# EAGLE design Raine (EAGLE 9.6.2)

## Sheet 1 of 5
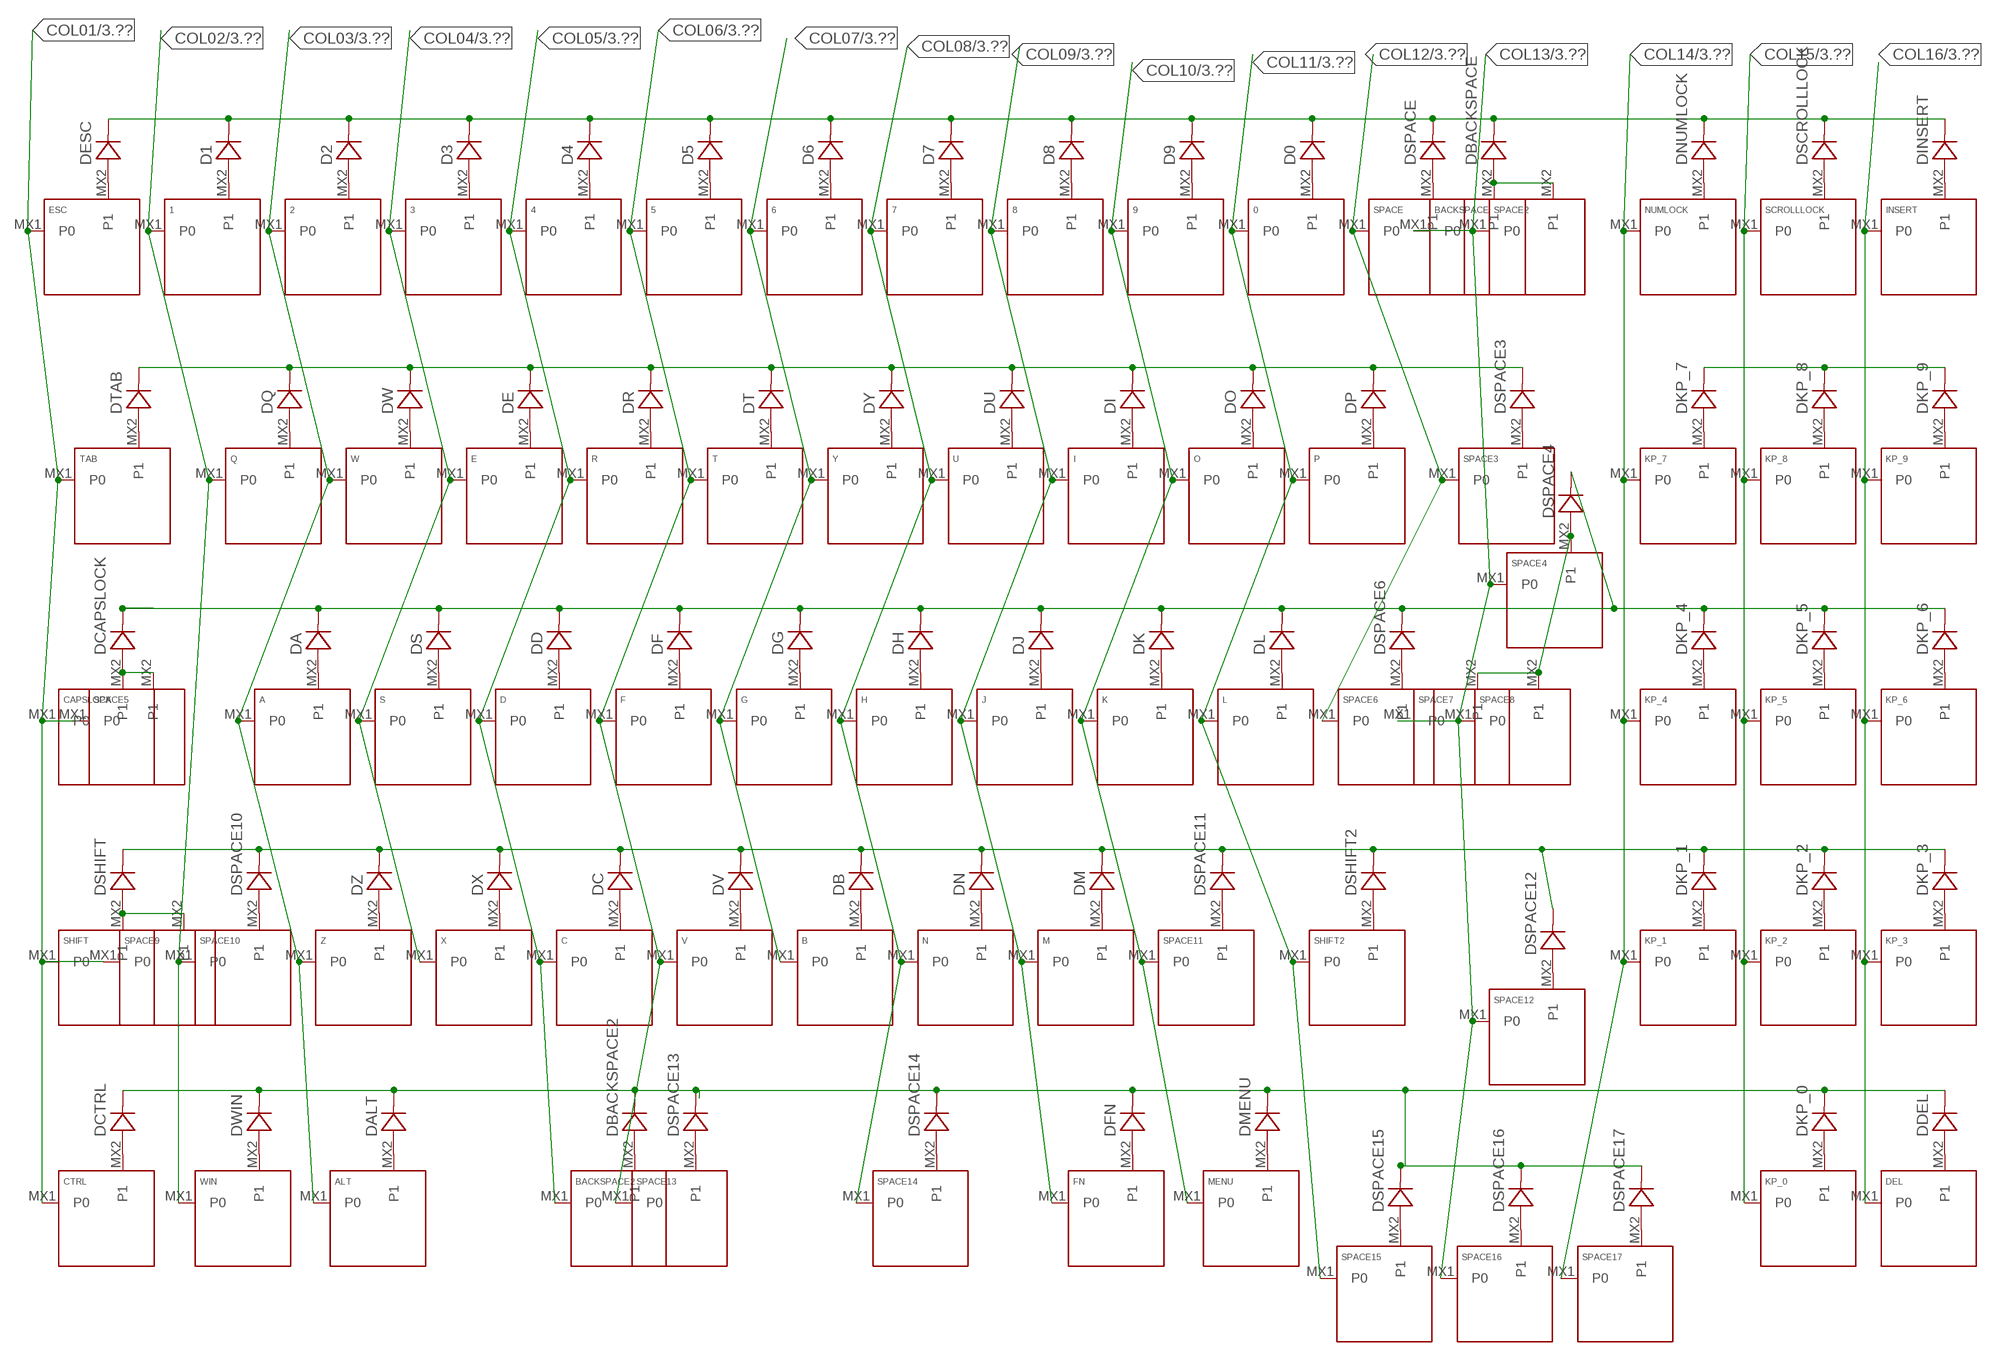
[diagram p0: schematic, sheet 1]

### Parts
0  KEYSWITCHMX-1U  [MX-1U]
1  KEYSWITCHMX-1U  [MX-1U]
2  KEYSWITCHMX-1U  [MX-1U]
3  KEYSWITCHMX-1U  [MX-1U]
4  KEYSWITCHMX-1U  [MX-1U]
5  KEYSWITCHMX-1U  [MX-1U]
6  KEYSWITCHMX-1U  [MX-1U]
7  KEYSWITCHMX-1U  [MX-1U]
8  KEYSWITCHMX-1U  [MX-1U]
9  KEYSWITCHMX-1U  [MX-1U]
A  KEYSWITCHMX-1U  [MX-1U]
ALT  KEYSWITCHMX-1U  [MX-1U]
B  KEYSWITCHMX-1U  [MX-1U]
BACKSPACE  KEYSWITCHMX-2U  [MX-2U]
BACKSPACE2  KEYSWITCHMX-2U-FLIPPED  [MX-2U-FLIPPED]
C  KEYSWITCHMX-1U  [MX-1U]
CAPSLOCK  KEYSWITCHMX-1U  [MX-1U]
CTRL  KEYSWITCHMX-1U  [MX-1U]
D  KEYSWITCHMX-1U  [MX-1U]
D0  D_SOD123-SOD-123  [SOD-123]
D1  D_SOD123-SOD-123  [SOD-123]
D2  D_SOD123-SOD-123  [SOD-123]
D3  D_SOD123-SOD-123  [SOD-123]
D4  D_SOD123-SOD-123  [SOD-123]
D5  D_SOD123-SOD-123  [SOD-123]
D6  D_SOD123-SOD-123  [SOD-123]
D7  D_SOD123-SOD-123  [SOD-123]
D8  D_SOD123-SOD-123  [SOD-123]
D9  D_SOD123-SOD-123  [SOD-123]
DA  D_SOD123-SOD-123  [SOD-123]
DALT  D_SOD123-SOD-123  [SOD-123]
DB  D_SOD123-SOD-123  [SOD-123]
DBACKSPACE  D_SOD123-SOD-123  [SOD-123]
DBACKSPACE2  D_SOD123-SOD-123  [SOD-123]
DC  D_SOD123-SOD-123  [SOD-123]
DCAPSLOCK  D_SOD123-SOD-123  [SOD-123]
DCTRL  D_SOD123-SOD-123  [SOD-123]
DD  D_SOD123-SOD-123  [SOD-123]
DDEL  D_SOD123-SOD-123  [SOD-123]
DE  D_SOD123-SOD-123  [SOD-123]
DEL  KEYSWITCHMX-1U  [MX-1U]
DESC  D_SOD123-SOD-123  [SOD-123]
DF  D_SOD123-SOD-123  [SOD-123]
DFN  D_SOD123-SOD-123  [SOD-123]
DG  D_SOD123-SOD-123  [SOD-123]
DH  D_SOD123-SOD-123  [SOD-123]
DI  D_SOD123-SOD-123  [SOD-123]
DINSERT  D_SOD123-SOD-123  [SOD-123]
DJ  D_SOD123-SOD-123  [SOD-123]
DK  D_SOD123-SOD-123  [SOD-123]
DKP_0  D_SOD123-SOD-123  [SOD-123]
DKP_1  D_SOD123-SOD-123  [SOD-123]
DKP_2  D_SOD123-SOD-123  [SOD-123]
DKP_3  D_SOD123-SOD-123  [SOD-123]
DKP_4  D_SOD123-SOD-123  [SOD-123]
DKP_5  D_SOD123-SOD-123  [SOD-123]
DKP_6  D_SOD123-SOD-123  [SOD-123]
DKP_7  D_SOD123-SOD-123  [SOD-123]
DKP_8  D_SOD123-SOD-123  [SOD-123]
DKP_9  D_SOD123-SOD-123  [SOD-123]
DL  D_SOD123-SOD-123  [SOD-123]
DM  D_SOD123-SOD-123  [SOD-123]
DMENU  D_SOD123-SOD-123  [SOD-123]
DN  D_SOD123-SOD-123  [SOD-123]
DNUMLOCK  D_SOD123-SOD-123  [SOD-123]
DO  D_SOD123-SOD-123  [SOD-123]
DP  D_SOD123-SOD-123  [SOD-123]
DQ  D_SOD123-SOD-123  [SOD-123]
DR  D_SOD123-SOD-123  [SOD-123]
DS  D_SOD123-SOD-123  [SOD-123]
DSCROLLLOCK  D_SOD123-SOD-123  [SOD-123]
DSHIFT  D_SOD123-SOD-123  [SOD-123]
DSHIFT2  D_SOD123-SOD-123  [SOD-123]
DSPACE  D_SOD123-SOD-123  [SOD-123]
DSPACE3  D_SOD123-SOD-123  [SOD-123]
DSPACE4  D_SOD123-SOD-123  [SOD-123]
DSPACE6  D_SOD123-SOD-123  [SOD-123]
DSPACE10  D_SOD123-SOD-123  [SOD-123]
DSPACE11  D_SOD123-SOD-123  [SOD-123]
DSPACE12  D_SOD123-SOD-123  [SOD-123]
DSPACE13  D_SOD123-SOD-123  [SOD-123]
DSPACE14  D_SOD123-SOD-123  [SOD-123]
DSPACE15  D_SOD123-SOD-123  [SOD-123]
DSPACE16  D_SOD123-SOD-123  [SOD-123]
DSPACE17  D_SOD123-SOD-123  [SOD-123]
DT  D_SOD123-SOD-123  [SOD-123]
DTAB  D_SOD123-SOD-123  [SOD-123]
DU  D_SOD123-SOD-123  [SOD-123]
DV  D_SOD123-SOD-123  [SOD-123]
DW  D_SOD123-SOD-123  [SOD-123]
DWIN  D_SOD123-SOD-123  [SOD-123]
DX  D_SOD123-SOD-123  [SOD-123]
DY  D_SOD123-SOD-123  [SOD-123]
DZ  D_SOD123-SOD-123  [SOD-123]
E  KEYSWITCHMX-1U  [MX-1U]
ESC  KEYSWITCHMX-1U  [MX-1U]
F  KEYSWITCHMX-1U  [MX-1U]
FN  KEYSWITCHMX-1U  [MX-1U]
G  KEYSWITCHMX-1U  [MX-1U]
H  KEYSWITCHMX-1U  [MX-1U]
I  KEYSWITCHMX-1U  [MX-1U]
INSERT  KEYSWITCHMX-1U  [MX-1U]
J  KEYSWITCHMX-1U  [MX-1U]
K  KEYSWITCHMX-1U  [MX-1U]
KP_0  KEYSWITCHMX-1U  [MX-1U]
KP_1  KEYSWITCHMX-1U  [MX-1U]
KP_2  KEYSWITCHMX-1U  [MX-1U]
KP_3  KEYSWITCHMX-1U  [MX-1U]
KP_4  KEYSWITCHMX-1U  [MX-1U]
KP_5  KEYSWITCHMX-1U  [MX-1U]
KP_6  KEYSWITCHMX-1U  [MX-1U]
KP_7  KEYSWITCHMX-1U  [MX-1U]
KP_8  KEYSWITCHMX-1U  [MX-1U]
KP_9  KEYSWITCHMX-1U  [MX-1U]
L  KEYSWITCHMX-1U  [MX-1U]
M  KEYSWITCHMX-1U  [MX-1U]
MENU  KEYSWITCHMX-1U  [MX-1U]
N  KEYSWITCHMX-1U  [MX-1U]
NUMLOCK  KEYSWITCHMX-1U  [MX-1U]
O  KEYSWITCHMX-1U  [MX-1U]
P  KEYSWITCHMX-1U  [MX-1U]
Q  KEYSWITCHMX-1U  [MX-1U]
R  KEYSWITCHMX-1U  [MX-1U]
S  KEYSWITCHMX-1U  [MX-1U]
SCROLLLOCK  KEYSWITCHMX-1U  [MX-1U]
SHIFT  KEYSWITCHMX-1U  [MX-1U]
SHIFT2  KEYSWITCHMX-1U  [MX-1U]
SPACE  KEYSWITCHMX-1U  [MX-1U]
SPACE2  KEYSWITCHMX-1U  [MX-1U]
SPACE3  KEYSWITCHMX-1U  [MX-1U]
SPACE4  KEYSWITCHMX-2U-FLIPPED  [MX-2U-FLIPPED]
SPACE5  KEYSWITCHMX-1U  [MX-1U]
SPACE6  KEYSWITCHMX-1U  [MX-1U]
SPACE7  KEYSWITCHMX-2U  [MX-2U]
SPACE8  KEYSWITCHMX-1U  [MX-1U]
SPACE9  KEYSWITCHMX-2U  [MX-2U]
SPACE10  KEYSWITCHMX-1U  [MX-1U]
SPACE11  KEYSWITCHMX-1U  [MX-1U]
SPACE12  KEYSWITCHMX-1U  [MX-1U]
SPACE13  KEYSWITCHMX-6.25U-FLIPPED  [MX-6.25U-FLIPPED]
SPACE14  KEYSWITCHMX-2U-FLIPPED  [MX-2U-FLIPPED]
SPACE15  KEYSWITCHMX-1U  [MX-1U]
SPACE16  KEYSWITCHMX-1U  [MX-1U]
SPACE17  KEYSWITCHMX-1U  [MX-1U]
T  KEYSWITCHMX-1U  [MX-1U]
TAB  KEYSWITCHMX-1U  [MX-1U]
U  KEYSWITCHMX-1U  [MX-1U]
V  KEYSWITCHMX-1U  [MX-1U]
W  KEYSWITCHMX-1U  [MX-1U]
WIN  KEYSWITCHMX-1U  [MX-1U]
X  KEYSWITCHMX-1U  [MX-1U]
Y  KEYSWITCHMX-1U  [MX-1U]
Z  KEYSWITCHMX-1U  [MX-1U]

### Nets
COL01: CAPSLOCK.MX1(P0) CTRL.MX1(P0) ESC.MX1(P0) SHIFT.MX1(P0) SPACE5.MX1(P0) SPACE9.MX1(P0) TAB.MX1(P0) ; also sheet 3
COL02: 1.MX1(P0) Q.MX1(P0) SPACE10.MX1(P0) WIN.MX1(P0) ; also sheet 3
COL03: 2.MX1(P0) A.MX1(P0) ALT.MX1(P0) W.MX1(P0) Z.MX1(P0) ; also sheet 3
COL04: 3.MX1(P0) E.MX1(P0) S.MX1(P0) X.MX1(P0) ; also sheet 3
COL05: 4.MX1(P0) BACKSPACE2.MX1(P0) C.MX1(P0) D.MX1(P0) R.MX1(P0) ; also sheet 3
COL06: 5.MX1(P0) F.MX1(P0) SPACE13.MX1(P0) T.MX1(P0) V.MX1(P0) ; also sheet 3
COL07: 6.MX1(P0) B.MX1(P0) G.MX1(P0) Y.MX1(P0) ; also sheet 3
COL08: 7.MX1(P0) H.MX1(P0) N.MX1(P0) SPACE14.MX1(P0) U.MX1(P0) ; also sheet 3
COL09: 8.MX1(P0) FN.MX1(P0) I.MX1(P0) J.MX1(P0) M.MX1(P0) ; also sheet 3
COL10: 9.MX1(P0) K.MX1(P0) MENU.MX1(P0) O.MX1(P0) SPACE11.MX1(P0) ; also sheet 3
COL11: 0.MX1(P0) L.MX1(P0) P.MX1(P0) SHIFT2.MX1(P0) SPACE15.MX1(P0) ; also sheet 3
COL12: SPACE3.MX1(P0) SPACE6.MX1(P0) SPACE.MX1(P0) ; also sheet 3
COL13: BACKSPACE.MX1(P0) SPACE2.MX1(P0) SPACE4.MX1(P0) SPACE7.MX1(P0) SPACE8.MX1(P0) SPACE12.MX1(P0) SPACE16.MX1(P0) ; also sheet 3
COL14: KP_1.MX1(P0) KP_4.MX1(P0) KP_7.MX1(P0) NUMLOCK.MX1(P0) SPACE17.MX1(P0) ; also sheet 3
COL15: KP_0.MX1(P0) KP_2.MX1(P0) KP_5.MX1(P0) KP_8.MX1(P0) SCROLLLOCK.MX1(P0) ; also sheet 3
COL16: DEL.MX1(P0) INSERT.MX1(P0) KP_3.MX1(P0) KP_6.MX1(P0) KP_9.MX1(P0) ; also sheet 3
N$1: DTAB.A TAB.MX2(P1)
N$2: DQ.A Q.MX2(P1)
N$3: DW.A W.MX2(P1)
N$4: DE.A E.MX2(P1)
N$5: DR.A R.MX2(P1)
N$6: DT.A T.MX2(P1)
N$7: DY.A Y.MX2(P1)
N$8: DU.A U.MX2(P1)
N$9: DI.A I.MX2(P1)
N$10: DO.A O.MX2(P1)
N$11: DP.A P.MX2(P1)
N$12: DSPACE3.A SPACE3.MX2(P1)
N$13: DKP_7.A KP_7.MX2(P1)
N$14: DKP_8.A KP_8.MX2(P1)
N$15: DKP_9.A KP_9.MX2(P1)
N$16: DNUMLOCK.A NUMLOCK.MX2(P1)
N$17: CAPSLOCK.MX2(P1) DCAPSLOCK.A SPACE5.MX2(P1)
N$18: A.MX2(P1) DA.A
N$19: DS.A S.MX2(P1)
N$20: D.MX2(P1) DD.A
N$21: DF.A F.MX2(P1)
N$22: DG.A G.MX2(P1)
N$23: DH.A H.MX2(P1)
N$24: DJ.A J.MX2(P1)
N$25: DK.A K.MX2(P1)
N$26: DL.A L.MX2(P1)
N$27: DSPACE6.A SPACE6.MX2(P1)
N$28: DSPACE4.A SPACE4.MX2(P1) SPACE7.MX2(P1) SPACE8.MX2(P1)
N$29: DSCROLLLOCK.A SCROLLLOCK.MX2(P1)
N$30: DKP_4.A KP_4.MX2(P1)
N$31: DKP_5.A KP_5.MX2(P1)
N$32: DKP_6.A KP_6.MX2(P1)
N$33: DSHIFT.A SHIFT.MX2(P1) SPACE9.MX2(P1)
N$34: DINSERT.A INSERT.MX2(P1)
N$35: DSPACE10.A SPACE10.MX2(P1)
N$36: DZ.A Z.MX2(P1)
N$37: DX.A X.MX2(P1)
N$38: C.MX2(P1) DC.A
N$39: DV.A V.MX2(P1)
N$40: B.MX2(P1) DB.A
N$41: DN.A N.MX2(P1)
N$42: DM.A M.MX2(P1)
N$43: DSPACE11.A SPACE11.MX2(P1)
N$44: DSHIFT2.A SHIFT2.MX2(P1)
N$45: DKP_1.A KP_1.MX2(P1)
N$46: DKP_2.A KP_2.MX2(P1)
N$47: DKP_3.A KP_3.MX2(P1)
N$48: DSPACE12.A SPACE12.MX2(P1)
N$49: CTRL.MX2(P1) DCTRL.A
N$50: DWIN.A WIN.MX2(P1)
N$51: ALT.MX2(P1) DALT.A
N$52: DSPACE13.A SPACE13.MX2(P1)
N$53: BACKSPACE2.MX2(P1) DBACKSPACE2.A
N$54: DSPACE14.A SPACE14.MX2(P1)
N$55: DFN.A FN.MX2(P1)
N$56: DMENU.A MENU.MX2(P1)
N$57: DKP_0.A KP_0.MX2(P1)
N$58: DDEL.A DEL.MX2(P1)
N$59: DSPACE15.A SPACE15.MX2(P1)
N$60: DSPACE16.A SPACE16.MX2(P1)
N$61: DSPACE17.A SPACE17.MX2(P1)
N$62: DSPACE.A SPACE.MX2(P1)
N$63: 0.MX2(P1) D0.A
N$64: 9.MX2(P1) D9.A
N$65: 8.MX2(P1) D8.A
N$66: 7.MX2(P1) D7.A
N$67: 6.MX2(P1) D6.A
N$68: 5.MX2(P1) D5.A
N$69: DESC.A ESC.MX2(P1)
N$70: 1.MX2(P1) D1.A
N$71: 2.MX2(P1) D2.A
N$72: 3.MX2(P1) D3.A
N$73: 4.MX2(P1) D4.A
N$76: BACKSPACE.MX2(P1) DBACKSPACE.A SPACE2.MX2(P1)
ROW1: D0.C D1.C D2.C D3.C D4.C D5.C D6.C D7.C D8.C D9.C DBACKSPACE.C DESC.C DINSERT.C DNUMLOCK.C DSCROLLLOCK.C DSPACE.C ; also sheet 3
ROW2: DE.C DI.C DKP_7.C DKP_8.C DKP_9.C DO.C DP.C DQ.C DR.C DSPACE3.C DT.C DTAB.C DU.C DW.C DY.C ; also sheet 3
ROW3: DA.C DCAPSLOCK.C DD.C DF.C DG.C DH.C DJ.C DK.C DKP_4.C DKP_5.C DKP_6.C DL.C DS.C DSPACE4.C DSPACE6.C ; also sheet 3
ROW4: DB.C DC.C DKP_1.C DKP_2.C DKP_3.C DM.C DN.C DSHIFT2.C DSHIFT.C DSPACE10.C DSPACE11.C DSPACE12.C DV.C DX.C DZ.C ; also sheet 3
ROW5.25: DALT.C DBACKSPACE2.C DCTRL.C DDEL.C DFN.C DKP_0.C DMENU.C DSPACE13.C DSPACE14.C DSPACE15.C DSPACE16.C DSPACE17.C DWIN.C ; also sheet 3

## Sheet 2 of 5
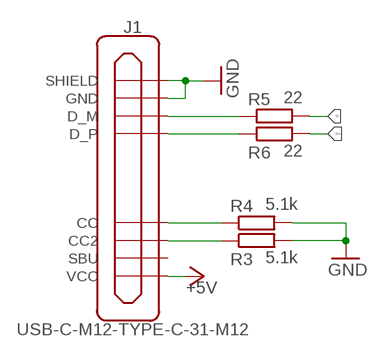
[diagram p1: schematic, sheet 2]

### Parts
J1  USB-C-M12-TYPE-C-31-M12  [TYPE-C-31-M-12]
R3  5.1k  R0603  [CAPC1608X90]
R4  5.1k  R0603  [CAPC1608X90]
R5  22  R0603  [CAPC1608X90]
R6  22  R0603  [CAPC1608X90]

### Nets
+5V: J1.P$2(VCC) J1.P$11(VCC) ; also sheet 3,5
D+: R6.2 ; also sheet 3
D-: R5.2 ; also sheet 3
GND: J1.P$1(GND) J1.P$12(GND) J1.P$13(SHIELD) J1.P$14(SHIELD) J1.P$15(SHIELD) J1.P$16(SHIELD) R3.2 R4.2 ; also sheet 3,4,5
N$74: J1.P$6(D_P) J1.P$8(D_P) R6.1
N$75: J1.P$5(D_M) J1.P$7(D_M) R5.1
N$77: J1.P$10(CC2) R3.1
N$78: J1.P$4(CC) R4.1
Unconnected: J1.P$3(SBU) J1.P$9(SBU)

## Sheet 3 of 5
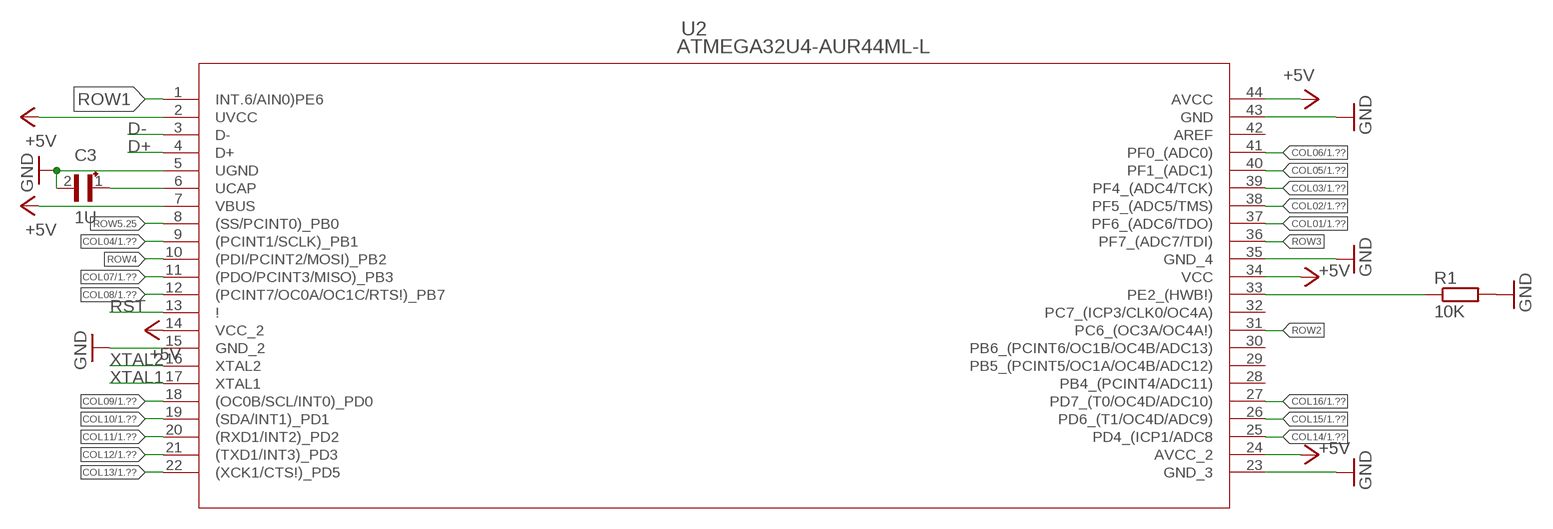
[diagram p2: schematic, sheet 3]

### Parts
C3  1U  C0603  [CAPC1608X90]
R1  10K  R0603  [CAPC1608X90]
U2  ATMEGA32U4-AUR44ML-L  [44ML-L]

### Nets
+5V: U2.2(UVCC) U2.7(VBUS) U2.14(VCC_2) U2.24(AVCC_2) U2.34(VCC) U2.44(AVCC) ; also sheet 2,5
COL01: U2.37(PF6_(ADC6/TDO)) ; also sheet 1
COL02: U2.38(PF5_(ADC5/TMS)) ; also sheet 1
COL03: U2.39(PF4_(ADC4/TCK)) ; also sheet 1
COL04: U2.9((PCINT1/SCLK)_PB1) ; also sheet 1
COL05: U2.40(PF1_(ADC1)) ; also sheet 1
COL06: U2.41(PF0_(ADC0)) ; also sheet 1
COL07: U2.11((PDO/PCINT3/MISO)_PB3) ; also sheet 1
COL08: U2.12((PCINT7/OC0A/OC1C/RTS!)_PB7) ; also sheet 1
COL09: U2.18((OC0B/SCL/INT0)_PD0) ; also sheet 1
COL10: U2.19((SDA/INT1)_PD1) ; also sheet 1
COL11: U2.20((RXD1/INT2)_PD2) ; also sheet 1
COL12: U2.21((TXD1/INT3)_PD3) ; also sheet 1
COL13: U2.22((XCK1/CTS!)_PD5) ; also sheet 1
COL14: U2.25(PD4_(ICP1/ADC8) ; also sheet 1
COL15: U2.26(PD6_(T1/OC4D/ADC9)) ; also sheet 1
COL16: U2.27(PD7_(T0/OC4D/ADC10)) ; also sheet 1
D+: U2.4(D+) ; also sheet 2
D-: U2.3(D-) ; also sheet 2
GND: C3.2 R1.2 U2.5(UGND) U2.15(GND_2) U2.23(GND_3) U2.35(GND_4) U2.43(GND) ; also sheet 2,4,5
N$87: C3.1 U2.6(UCAP)
N$88: R1.1 U2.33(PE2_(HWB!))
ROW1: U2.1(INT.6/AIN0)PE6) ; also sheet 1
ROW2: U2.31(PC6_(OC3A/OC4A!)) ; also sheet 1
ROW3: U2.36(PF7_(ADC7/TDI)) ; also sheet 1
ROW4: U2.10((PDI/PCINT2/MOSI)_PB2) ; also sheet 1
ROW5.25: U2.8((SS/PCINT0)_PB0) ; also sheet 1
RST: U2.13(!) ; also sheet 5
XTAL1: U2.17(XTAL1) ; also sheet 4
XTAL2: U2.16(XTAL2) ; also sheet 4
Unconnected: U2.28(PB4_(PCINT4/ADC11)) U2.29(PB5_(PCINT5/OC1A/OC4B/ADC12)) U2.30(PB6_(PCINT6/OC1B/OC4B/ADC13)) U2.32(PC7_(ICP3/CLK0/OC4A)) U2.42(AREF)

## Sheet 4 of 5
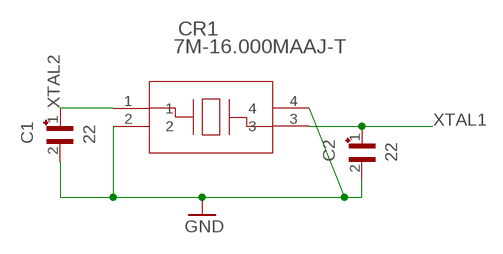
[diagram p3: schematic, sheet 4]

### Parts
C1  22  C0603  [CAPC1608X90]
C2  22  C0603  [CAPC1608X90]
CR1  7M-16.000MAAJ-T  [CRYSTAL_TXC_7M]

### Nets
GND: C1.2 C2.2 CR1.2 CR1.4 ; also sheet 2,3,5
XTAL1: C2.1 CR1.3 ; also sheet 3
XTAL2: C1.1 CR1.1 ; also sheet 3

## Sheet 5 of 5
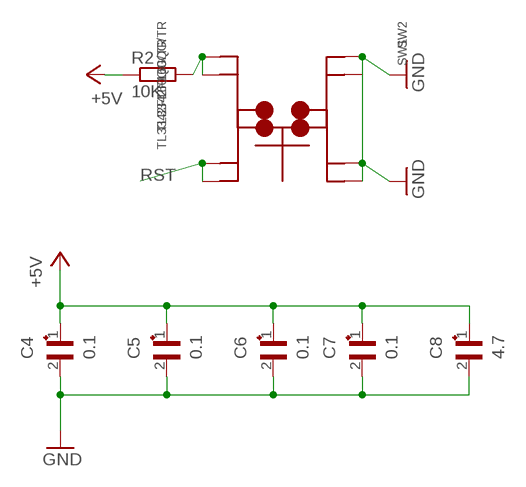
[diagram p4: schematic, sheet 5]

### Parts
C4  0.1  C0603  [CAPC1608X90]
C5  0.1  C0603  [CAPC1608X90]
C6  0.1  C0603  [CAPC1608X90]
C7  0.1  C0603  [CAPC1608X90]
C8  4.7  C0603  [CAPC1608X90]
R2  10K  R0603  [CAPC1608X90]
SW1  TL3342F160QG/TR  [SW_TL3342F160QG/TR]
SW2  TL3342F160QG/TR  [SW_TL3342F160QG/TR]

### Nets
+5V: C4.1 C5.1 C6.1 C7.1 C8.1 R2.1 ; also sheet 2,3
GND: C4.2 C5.2 C6.2 C7.2 C8.2 SW1.3 SW1.4 SW2.3 SW2.4 ; also sheet 2,3,4
N$89: R2.2 SW1.1 SW2.1
RST: SW1.2 SW2.2 ; also sheet 3

## Library data of the parts
0 1-9 A ALT B BACKSPACE BACKSPACE2 C CAPSLOCK CTRL D DEL E ESC F FN G H I INSERT J K KP_0 KP_1-KP_9 L M MENU N NUMLOCK O P Q R S SCROLLLOCK SHIFT SHIFT2 SPACE SPACE2-SPACE17 T TAB U V W WIN X Y Z = Keyboard_parts:KEYSWITCH
C1-C8 = Keyboard_parts:C0603: Capacitor 0603; AVAILABILITY: Unavailable; DESCRIPTION: Cap Cer 10000pf 10v 10% X7r 0603; MF: AVX; MP: 0603ZC103KAJ2A; PACKAGE: 0603 AVX; PRICE: None
CR1 = Keyboard_parts:7M-16.000MAAJ-T; MANUFACTURER_PART_NUMBER: 7M16.000MAAJT; VENDOR: TXC
D0 D1-D9 DA DALT DB DBACKSPACE DBACKSPACE2 DC DCAPSLOCK DCTRL DD DDEL DE DESC DF DFN DG DH DI DINSERT DJ DK DKP_0 DKP_1-DKP_9 DL DM DMENU DN DNUMLOCK DO DP DQ DR DS DSCROLLLOCK DSHIFT DSHIFT2 DSPACE DSPACE3 DSPACE4 DSPACE6 DSPACE10-DSPACE17 DT DTAB DU DV DW DWIN DX DY DZ = Keyboard_parts:D_SOD123: Standard 1N4148 diode
J1 = Keyboard_parts:USB-C-M12
R1-R6 = Keyboard_parts:R0603: Resistor 0603
SW1 SW2 = Keyboard_parts:TL3342F160QG/TR: TL3342 Series SPST 1.6 N Round Button Gull Wing Surface Mount Tactile Switch; DESCRIPTION: Switch Tactile Spst-No 0.05a 12v; DIGI-KEY_PART_NUMBER: EG2531CT-ND; DIGI-KEY_PURCHASE_URL: https://www.digikey.co.uk/product-detail/en/e-switch/TL3342F160QG-TR/EG2531CT-ND/379004?utm_source=snapeda&utm_medium=aggregator&utm_campaign=symbol; MF: E-Switch; MP: TL3342F160QG/TR; PACKAGE: FakePackage u
U2 = Keyboard_parts:ATMEGA32U4-AUR; MANUFACTURER_PART_NUMBER: ATMEGA32U4AUR; VENDOR: Atmel

## Board
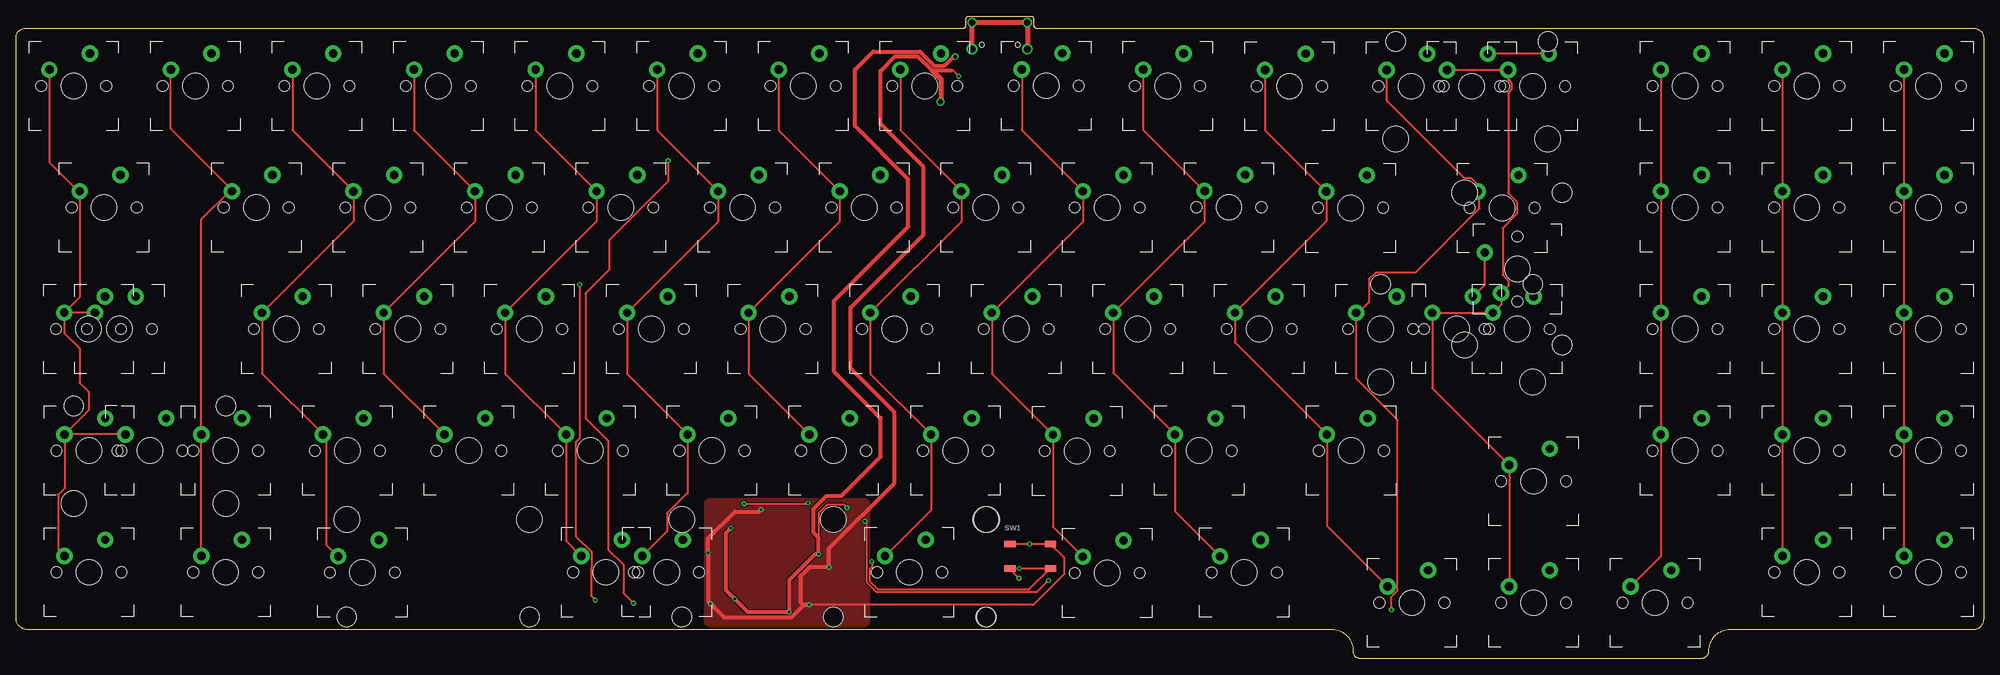
[diagram p5: board, top side]
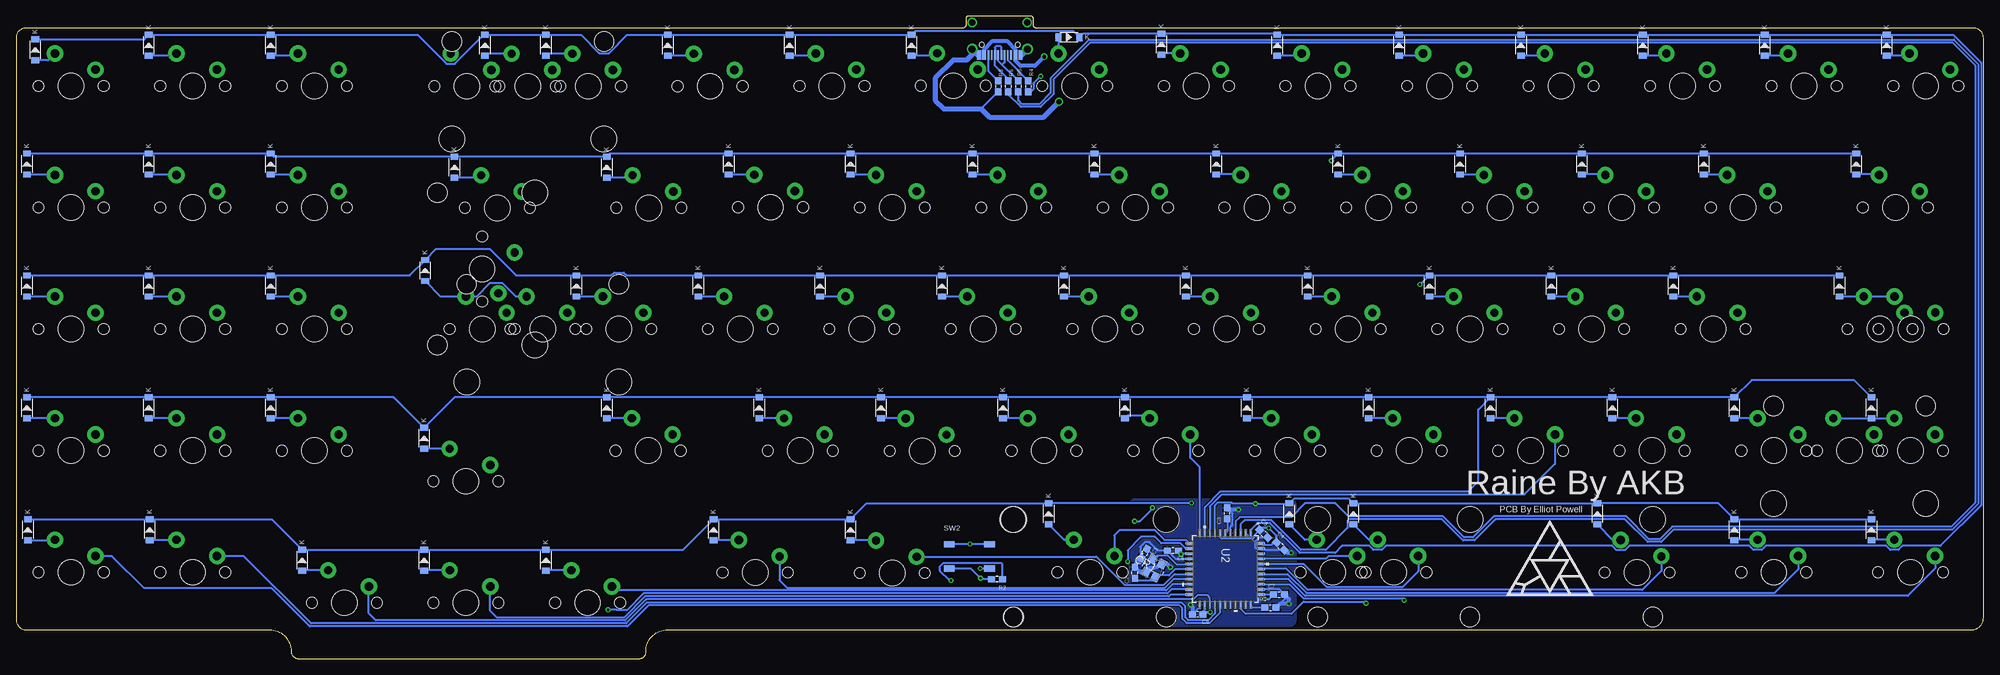
[diagram p6: board, bottom side, seen from below]

Size 307.5 x 100.4 mm. Coordinates in mm from the lower left corner, seen from the top.
Outline: 1.4,98.5 1.5,98.5
Outline: 1.5,98.5 148,98.5 arc90 148.5,99 148.5,100 arc-90 148.9,100.4 158.65,100.4 arc-90 159.05,100 159.05,99 arc90 159.55,98.5 306,98.5 arc-90 307.5,97 307.5,6.1 arc-90 305.9,4.5 267.85,4.5 arc90 264.5,1.15 arc-90 263.35,0 210.1,0 arc-90 209,1.1 209.05,1.15 arc90 205.7,4.5 1.85,4.5 arc-90 0,6.35 0,97 arc-90 1.5,98.5
Copper layers (1*16): Top 0.035mm / dielectric 1.5mm / Bottom 0.035mm
Design rules "default *": minimum track width 6mil, minimum drill 0.35mm, track to track 6mil, track to pad 6mil, pad to pad 6mil, via to via 6mil, smd to smd 6mil, copper to edge 6mil, drill to drill 6mil, minimum pad ring 10mil, minimum via ring 8mil, stop-mask expansion 4mil, vias tented up to drill 0mil, thermal gap 10mil

### Footprints (pad centres in the part's own frame; a part is rotated, then mirrored left to right if it is on the bottom)
MX-1U = drill 1.3 pad 2.54: MX1 -3.81,2.54; MX2 2.54,5.08 | hole 4: 0,0 | hole 1.7: -5.08,0; 5.08,0
MX-2U = drill 1.3 pad 2.54: MX1 -3.81,2.54; MX2 2.54,5.08 | hole 4: 0,0; -11.9,-8.24; 11.9,-8.24 | hole 1.7: -5.08,0; 5.08,0 | hole 3.05: -11.9,7; 11.9,7
MX-2U-FLIPPED = drill 1.3 pad 2.54: MX1 -3.81,2.54; MX2 2.54,5.08 | hole 4: 0,0; -11.9,8.24; 11.9,8.24 | hole 1.7: -5.08,0; 5.08,0 | hole 3.05: -11.9,-7; 11.9,-7
CAPC1608X90 = smd 1.1 x 1: 1 -0.85,0; 2 0.85,0
CRYSTAL_TXC_7M = smd 1.194 x 1.397: 1 -0.826,1.13; 2 -0.826,-1.13; 3 0.826,-1.13; 4 0.826,1.13
SOD-123 = smd 0.91 x 1.22: A -1.635,0; C 1.635,0
TYPE-C-31-M-12 = smd 0.6 x 1.45 bottom: P$1 -3.225,-7.695; P$2 -2.45,-7.695; P$11 2.45,-7.695; P$12 3.225,-7.695 | smd 0.3 x 1.45 bottom: P$3 -1.75,-7.695; P$4 -1.25,-7.695; P$5 -0.75,-7.695; P$6 -0.25,-7.695; P$7 0.25,-7.695; P$8 0.75,-7.695; P$9 1.25,-7.695; P$10 1.75,-7.695 | drill 1: P$13 4.32,-2.6; P$15 -4.32,-2.6 | drill 1.1: P$14 4.33,-6.78; P$16 -4.34,-6.78 | hole 0.75: -2.794,-6.096; 2.794,-6.096
MX-6.25U-FLIPPED = drill 1.3 pad 2.54: MX1 -3.81,2.54; MX2 2.54,5.08 | hole 4: 0,0; -50,8.24; 50,8.24 | hole 1.7: -5.08,0; 5.08,0 | hole 3.05: -50,-7; 50,-7
SW_TL3342F160QG/TR = smd 1.7 x 1: 1 -3.15,-1.9; 2 3.15,-1.9; 3 -3.15,1.9; 4 3.15,1.9
44ML-L = smd 1.168 x 0.356: 1 -5.613,4; 2 -5.613,3.2; 3 -5.613,2.4; 4 -5.613,1.6; 5 -5.613,0.8; 6 -5.613,0; 7 -5.613,-0.8; 8 -5.613,-1.6; 9 -5.613,-2.4; 10 -5.613,-3.2; 11 -5.613,-4; 23 5.613,-4; 24 5.613,-3.2; 25 5.613,-2.4; 26 5.613,-1.6; 27 5.613,-0.8; 28 5.613,0; 29 5.613,0.8; 30 5.613,1.6; 31 5.613,2.4; 32 5.613,3.2; 33 5.613,4 | smd 0.356 x 1.168: 12 -4,-5.613; 13 -3.2,-5.613; 14 -2.4,-5.613; 15 -1.6,-5.613; 16 -0.8,-5.613; 17 0,-5.613; 18 0.8,-5.613; 19 1.6,-5.613; 20 2.4,-5.613; 21 3.2,-5.613; 22 4,-5.613; 34 4,5.613; 35 3.2,5.613; 36 2.4,5.613; 37 1.6,5.613; 38 0.8,5.613; 39 0,5.613; 40 -0.8,5.613; 41 -1.6,5.613; 42 -2.4,5.613; 43 -3.2,5.613; 44 -4,5.613

### Placement (x,y rotation side)
0  199.02,89.43 0 top
1  28.02,89.48 0 top
2  47.02,89.48 0 top
3  66.02,89.48 0 top
4  85.02,89.48 0 top
5  104.02,89.48 0 top
6  123.02,89.48 0 top
7  142.02,89.48 0 top
8  161,89.5 0 top
9  179.97,89.48 0 top
A  42.26,51.48 0 top
ALT  54.16,13.43 0 top
B  127.78,32.48 0 top
BACKSPACE  227.5,89.43 0 top
BACKSPACE2  92.16,13.48 0 top
C  89.78,32.48 0 top
C1  131.15,16.4 240 bottom
C2  132.62,13.41 90 bottom
C3  118.2,22.7 90 bottom
C4  109.89,17.56 315 bottom
C5  122.81,6.9 180 bottom
C6  126.7,16.85 180 bottom
C7  110.1,10 0 bottom
C8  112.5,19.5 315 bottom
CAPSLOCK  11.35,51.51 0 top
CR1  129.65,14.15 332.3 bottom
CTRL  11.4,13.48 0 top
D  80.26,51.48 0 top
D0  205.63,95.82 90 bottom
D1  34.18,95.82 90 bottom
D2  53.23,95.82 90 bottom
D3  72.28,95.82 90 bottom
D4  91.33,95.82 90 bottom
D5  110.38,95.82 90 bottom
D6  128.48,95.97 90 bottom
D7  142.93,97.08 0 bottom
D8  167.53,95.82 90 bottom
D9  186.58,95.82 90 bottom
DA  48.47,58.22 90 bottom
DALT  60.37,22.62 90 bottom
DB  134.19,39.17 90 bottom
DBACKSPACE  234.21,95.82 90 bottom
DBACKSPACE2  98.47,22.62 90 bottom
DC  96.09,39.17 90 bottom
DCAPSLOCK  22.51,58.22 90 bottom
DCTRL  17.51,20.12 90 bottom
DD  86.57,58.22 90 bottom
DDEL  305.64,20.12 90 bottom
DE  81.81,77.27 90 bottom
DEL  298.88,13.48 0 top
DESC  15.13,95.82 90 bottom
DF  105.62,58.22 90 bottom
DFN  177.06,20.12 90 bottom
DG  124.67,58.22 90 bottom
DH  143.72,58.22 90 bottom
DI  177.06,77.27 90 bottom
DINSERT  304.49,95.12 90 bottom
DJ  162.77,58.22 90 bottom
DK  181.82,58.22 90 bottom
DKP_0  286.59,20.12 90 bottom
DKP_1  267.69,39.17 90 bottom
DKP_2  286.74,39.17 90 bottom
DKP_3  305.79,39.17 90 bottom
DKP_4  267.69,58.22 90 bottom
DKP_5  286.74,58.22 90 bottom
DKP_6  305.79,58.22 90 bottom
DKP_7  267.69,77.27 90 bottom
DKP_8  286.74,77.27 90 bottom
DKP_9  305.79,77.27 90 bottom
DL  200.87,58.22 90 bottom
DM  172.29,39.17 90 bottom
DMENU  198.49,20.12 90 bottom
DN  153.24,39.17 90 bottom
DNUMLOCK  267.69,95.82 90 bottom
DO  196.11,77.27 90 bottom
DP  215.16,76.77 90 bottom
DQ  43.71,77.27 90 bottom
DR  100.86,77.27 90 bottom
DS  67.52,58.22 90 bottom
DSCROLLLOCK  286.74,95.82 90 bottom
DSHIFT  17.51,39.17 90 bottom
DSHIFT2  215.16,39.17 90 bottom
DSPACE  224.68,95.82 90 bottom
DSPACE3  238.97,76.77 90 bottom
DSPACE4  243.55,60.64 90 bottom
DSPACE6  219.92,58.22 90 bottom
DSPACE10  38.94,39.17 90 bottom
DSPACE11  191.34,39.17 90 bottom
DSPACE12  243.73,34.41 90 bottom
DSPACE13  108.5,22.62 90 bottom
DSPACE14  146.1,22.62 90 bottom
DSPACE15  224.68,15.36 90 bottom
DSPACE16  243.73,15.36 90 bottom
DSPACE17  262.78,15.36 90 bottom
DT  119.91,77.27 90 bottom
DTAB  19.89,77.27 90 bottom
DU  158.01,77.27 90 bottom
DV  115.14,39.17 90 bottom
DW  62.76,77.27 90 bottom
DWIN  38.94,20.12 90 bottom
DX  77.04,39.17 90 bottom
DY  138.96,77.27 90 bottom
DZ  57.99,39.17 90 bottom
E  75.55,70.48 0 top
ESC  9.02,89.48 0 top
F  99.31,51.48 0 top
FN  170.55,13.38 0 top
G  118.31,51.48 0 top
H  137.31,51.48 0 top
I  170.55,70.48 0 top
INSERT  298.88,89.48 0 top
J  156.31,51.48 0 top
J1  153.75,102 0 top
K  175.31,51.48 0 top
KP_0  279.88,13.48 0 top
KP_1  260.88,32.48 0 top
KP_2  279.88,32.48 0 top
KP_3  298.88,32.48 0 top
KP_4  260.88,51.48 0 top
KP_5  279.88,51.48 0 top
KP_6  298.88,51.48 0 top
KP_7  260.88,70.48 0 top
KP_8  279.88,70.48 0 top
KP_9  298.88,70.48 0 top
L  194.31,51.48 0 top
M  165.88,32.43 0 top
MENU  191.98,13.43 0 top
N  146.83,32.48 0 top
NUMLOCK  260.88,89.48 0 top
O  189.57,70.51 0 top
P  208.6,70.43 0 top
Q  37.55,70.48 0 top
R  94.55,70.48 0 top
R1  111.45,7.95 0 bottom
R2  154.2,12.4 180 bottom
R3  154,89.4 270 bottom
R4  149.3,89.4 270 bottom
R5  150.85,89.4 270 bottom
R6  152.45,89.4 270 bottom
S  61.26,51.48 0 top
SCROLLLOCK  279.88,89.48 0 top
SHIFT  11.4,32.48 0 top
SHIFT2  208.7,32.48 0 top
SPACE  218.02,89.43 0 top
SPACE2  237.02,89.43 0 top
SPACE3  232.26,70.43 0 top
SPACE4  234.65,60.89 90 top
SPACE5  16.16,51.48 0 top
SPACE6  213.26,51.48 0 top
SPACE7  225.16,51.48 0 top
SPACE8  234.64,51.48 0 top
SPACE9  20.93,32.48 0 top
SPACE10  32.78,32.48 0 top
SPACE11  184.93,32.48 0 top
SPACE12  237.19,27.7 0 top
SPACE13  101.69,13.48 0 top
SPACE14  139.64,13.48 0 top
SPACE15  218.17,8.72 0 top
SPACE16  237.17,8.72 0 top
SPACE17  256.17,8.72 0 top
SW1  158.5,16 0 top
SW2  158.48,15.97 0 bottom
T  113.55,70.48 0 top
TAB  13.78,70.49 0 top
U  151.55,70.48 0 top
U2  118.5,14 270 bottom
V  108.78,32.48 0 top
W  56.56,70.46 0 top
WIN  32.78,13.48 0 top
X  70.78,32.48 0 top
Y  132.55,70.48 0 top
Z  51.78,32.48 0 top

### Tracks (layer width: path | path; a pad name or v marks a point on that pad's centre or on a via)
+5V  (via drill 0.35, 0.6)
  Top 0.305: v161.35,12.2 159.49,10.34 134.51,10.34 132.95,11.91 132.95,21.18 v132.67,21.46 | v129.9,23.55 129.43,24.03 126.78,24.03 125.44,22.67 125.44,20.77 125.45,20.75 125.45,18.85
  Top 0.61: v111.72,20.41 110.97,19.66 110.97,10.68 v112.35,9.3 114.39,7.26 v120.86,7.26 120.86,12.26 124.88,16.28 v125.45,16.28 125.45,18.85 124.65,19.65 124.65,23.38 126.68,25.41 129,25.41 135.13,31.54 135.13,37.57 127.85,44.85 127.85,55.91 139.44,67.5 139.44,74.88 131.1,83.22 131.1,92 | 131.1,92 131.1,92.05 | 131.1,92 133.95,94.85 141.25,94.85 143.45,92.65 145.09,92.65 146.49,94.05 v146.8,94.05
  Bottom 0.305: U2.44 112.69,17.8 111.24,17.8 110.87,18.17 C4.1 | U2.24 121.7,7.6 121.9,7.4 | 121.68,7.18 C5.1 | U2.14 125.4,16.4 C6.1 | U2.2 114.98,19.3 114.98,18.9 114.8,18.72 | 114.8,18.72 119.12,18.72 119.25,18.85 119.25,19.56 U2.7 | C7.1 U2.34 | C8.1 114.02,19.19 114.02,18.9 114.2,18.72 114.8,18.72 | R2.1 153.35,14.7 153.55,14.9 162.6,14.9 163.15,14.35 163.15,13.75 161.6,12.2 v161.35,12.2 | v132.67,21.46 131.84,21.46 129.9,23.41 v129.9,23.55
  Bottom 0.406: v120.86,7.26 121.76,7.26 | 121.68,7.18 121.76,7.26 | 121.76,7.26 121.9,7.4 | C6.1 125.85,16.68 v125.45,16.28 | C7.1 111.65,9.3 v112.35,9.3 | C4.1 110.49,19.18 v111.72,20.41 112.8,20.41 C8.1
  Bottom 0.61: v146.8,94.05 148.25,92.6 150.49,92.6 151.3,93.41 J1.P$2 151.3,95.15 152.65,96.5 154.85,96.5 156.2,95.15 J1.P$11
COL01
  Top 0.305: ESC.MX1 5.21,77.53 9.71,73.03 TAB.MX1 9.97,56.48 CAPSLOCK.MX1 | SPACE5.MX1 7.57,54.02 CAPSLOCK.MX1 | CAPSLOCK.MX1 7.54,50.85 9.93,48.47 9.93,43.08 11.34,41.67 11.34,38.77 SHIFT.MX1 | SPACE9.MX1 SHIFT.MX1 | SHIFT.MX1 7.59,26.63 6.58,25.62 6.58,17.03 CTRL.MX1
  Bottom 0.305: CTRL.MX1 7.54,15.97 7.54,14.08 11.82,9.8 106.02,9.8 108.62,12.4 U2.37
COL02
  Top 0.305: WIN.MX1 SPACE10.MX1 28.97,68.61 33.38,73.02 Q.MX1 33.74,73.26 24.21,82.79 1.MX1
  Bottom 0.305: U2.38 108.77,13.2 105.83,10.26 32.64,10.26 28.97,13.93 WIN.MX1
COL03
  Top 0.305: 2.MX1 43.21,82.54 W.MX1 52.75,68.32 A.MX1 38.45,44.54 Z.MX1 48.5,34.49 48.5,17.82 ALT.MX1
  Bottom 0.305: ALT.MX1 50.35,13.7 53.33,10.72 105.64,10.72 108.92,14 U2.39
COL04
  Top 0.305: 3.MX1 62.22,82.53 71.72,73.02 E.MX1 71.74,68.31 S.MX1 57.45,44.54 X.MX1
  Bottom 0.305: U2.9 120.93,19.65 120.93,23.76 119.05,25.65 71.75,25.65 66.97,30.43 X.MX1
COL05
  Top 0.305: 4.MX1 81.21,82.55 R.MX1 90.74,68.31 D.MX1 76.45,44.54 C.MX1 85.97,18.4 BACKSPACE2.MX1
  Bottom 0.305: BACKSPACE2.MX1 88.35,13.67 90.84,11.17 102.64,11.17 106.27,14.8 U2.40
COL06
  Top 0.305: 5.MX1 100.21,82.55 T.MX1 109.74,68.26 F.MX1 95.5,44.49 V.MX1 104.97,25.89 101.75,22.67 101.75,19.89 SPACE13.MX1
  Bottom 0.305: SPACE13.MX1 102.35,16.02 102.77,15.6 U2.41
COL07
  Top 0.305: 6.MX1 119.21,82.55 Y.MX1 128.74,68.26 G.MX1 114.5,44.49 B.MX1
  Bottom 0.305: U2.11 122.5,29.9 123.55,30.95 123.95,31.35 123.97,31.37 B.MX1
COL08
  Top 0.305: 7.MX1 138.21,82.55 U.MX1 147.74,68.26 H.MX1 133.5,44.54 N.MX1 143.02,23.21 SPACE14.MX1
  Bottom 0.305: U2.12 124.66,18.55 128.02,18.55 129.49,20.02 135.06,20.02 135.06,20.01 135.83,19.24 SPACE14.MX1
COL09
  Top 0.305: 8.MX1 157.19,82.57 I.MX1 166.74,68.26 J.MX1 152.5,44.54 M.MX1 162.07,20.59 FN.MX1
  Bottom 0.305: FN.MX1 138.63,15.92 134.28,11.57 128.07,11.57 126.44,13.2 U2.18
COL10
  Top 0.305: 9.MX1 176.16,82.65 O.MX1 185.76,68.28 K.MX1 171.5,44.64 SPACE11.MX1 181.12,23.02 MENU.MX1
  Bottom 0.305: MENU.MX1 188.17,12.27 187,11.1 127.89,11.1 126.59,12.4 U2.19
COL11
  Top 0.305: 0.MX1 195.21,82.55 P.MX1 204.79,68.31 L.MX1 190.5,49.41 SHIFT2.MX1 204.89,20.73 SPACE15.MX1
  Bottom 0.305: U2.20 126.75,11.6 127.7,10.64 213.79,10.64 214.36,11.21 SPACE15.MX1
COL12  (via drill 0.35)
  Top 0.305: SPACE.MX1 214.21,87.21 226.32,75.09 227.37,75.09 228.45,74.01 | 228.45,74.01 228.72,73.75 228.72,72 | 209.5,54.02 209.76,54.02 211.43,55.69 211.43,59.24 212.5,60.31 218.69,60.31 228.72,70.33 228.72,72 | 209.5,54.02 SPACE6.MX1 | 228.45,74.01 SPACE3.MX1 228.45,72.27 228.72,72 | v214.95,7.6 214.95,9.62 215.94,10.61 215.94,37.31 209.5,43.74 209.5,54.02
  Bottom 0.305: U2.21 126.9,10.8 127.53,10.17 209.38,10.17 211.99,7.56 213.57,7.56 213.6,7.6 v214.95,7.6
COL13
  Top 0.305: BACKSPACE.MX1 SPACE2.MX1 233.21,90.43 233.74,89.91 233.74,88.95 233.21,88.43 233.21,72.74 234.56,71.39 234.56,69.47 232.34,67.26 232.34,59.94 233.21,59.07 233.21,58.18 SPACE4.MX1 232.11,55.3 SPACE8.MX1 SPACE7.MX1 221.35,42.27 SPACE12.MX1 233.38,11.28 SPACE16.MX1
  Bottom 0.305: U2.22 127.05,10 127.34,9.71 209.19,9.71 212.49,6.42 232.31,6.42 233.4,7.5 233.4,11.22 SPACE16.MX1
COL14
  Top 0.305: NUMLOCK.MX1 KP_7.MX1 KP_4.MX1 KP_1.MX1 257.07,15.97 SPACE17.MX1
  Bottom 0.305: SPACE17.MX1 252.36,7.06 251.26,5.96 212.3,5.96 209.02,9.24 123.51,9.24 122.89,9.86 121.25,9.86 120.9,9.52 U2.25
COL15
  Top 0.305: SCROLLLOCK.MX1 KP_8.MX1 KP_5.MX1 KP_2.MX1 KP_0.MX1
  Bottom 0.305: U2.26 120.1,7.05 121.17,5.98 124.29,5.98 124.75,6.44 124.75,8.15 125.38,8.78 208.83,8.78 212.11,5.5 261.4,5.5 271.92,16.02 KP_0.MX1
COL16
  Top 0.305: INSERT.MX1 KP_9.MX1 KP_6.MX1 KP_3.MX1 DEL.MX1
  Bottom 0.305: U2.27 119.3,7.16 120.96,5.5 124.5,5.5 125.21,6.21 125.21,7.86 125.66,8.32 208.65,8.32 211.92,5.04 261.59,5.04 267.55,11 287.5,11 292.52,16.02 DEL.MX1
D+
  Bottom 0.305: U2.4 116.9,21.45 116.25,22.1 108.2,22.1 106.05,24.25 101.3,24.25 99.25,22.2 84.45,22.2 81.17,18.92 79.78,18.92 76.5,22.2 55.84,22.2 52.3,18.67 50.58,18.67 48.64,20.61 5.04,20.61 1.29,24.35 1.29,92.7 4.83,96.24 139.62,96.24 145.34,90.51 145.34,88.21 147.36,86.19 150.44,86.19 152.45,88.2 R6.2
D-
  Bottom 0.305: U2.3 116.1,21 115.5,21.6 111.3,21.6 106.69,16.98 102.8,16.98 99.39,20.4 99.39,21.57 99.21,21.75 84.64,21.75 81.36,18.47 79.56,18.47 76.28,21.75 56.02,21.75 52.49,18.22 50.38,18.22 48.45,20.15 4.85,20.15 0.84,24.16 0.84,92.89 4.64,96.69 139.81,96.69 145.8,90.7 145.8,88.4 147.55,86.65 150.25,86.65 150.85,87.25 R5.2
GND  (via drill 0.35, 0.8)
  Top 0.152: 143.5,91.89 143.13,91.89
  Top 0.305: v147.35,91 146.46,91.89 145.5,91.89 | v123.95,8.4 159,8.4 163.75,13.15 163.75,15.8 SW1.4 v158.39,17.9 SW1.3
  Top 0.61: v116.45,23.25 116.15,22.95 112.35,22.95 108.2,18.8 v108.2,16.55 108.2,8.9 v108.55,8.55 110.68,6.42 121.2,6.42 123.18,8.4 v123.95,8.4 123,8.4 122.6,8.8 122.6,12.85 124,14.25 v127.05,14.25 127.05,17.2 137.28,27.43 137.28,38.49 130.43,45.34 130.43,54.85 141.82,66.24 141.82,76.83 135.1,83.55 135.1,91.8 137.39,94.09 140.93,94.09 143.13,91.89 143.23,91.89 143.33,91.79 | 143.5,91.89 145.5,91.89 146.09,91.89
  Top 0.813: v144.5,87 144.58,87.08 144.58,90.54 143.33,91.79 143.45,91.79 | J1.P$16 149.41,99.38 J1.P$15 J1.P$13 J1.P$14
  Bottom 0.152: J1.P$12 157.16,94.31
  Bottom 0.2: 150.28,94.31 J1.P$1
  Bottom 0.305: C4.2 109.31,16.99 112.68,16.99 U2.43 113.7,17.2 113.85,17.35 113.85,18.25 113.2,18.9 C8.2 | U2.5 117.7,20.52 117.34,20.87 117.34,22.69 C3.2 | C5.2 122.5,8.06 U2.23 | U2.15 126.3,15.6 C6.2 129,16.85 130.34,18.19 131.02,18.19 131.76,17.45 131.76,15.85 C1.2 | U2.35 111.63,10.8 111.63,10.81 110.06,10.81 C7.2 109.25,9.25 110.5,8 110.55,7.95 R1.2 | v147.35,91 148.5,89.86 148.5,88.92 148.87,88.55 R4.2 | SW2.4 158.39,17.87 | 158.39,17.87 SW2.3 | 158.39,17.87 v158.39,17.9 | R3.2 156.65,85.9
  Bottom 0.61: C4.2 108.88,16.55 v108.2,16.55 | C7.2 108.55,9.3 v108.55,8.55 109.95,8.55 110.5,8 | v123.95,8.4 123.66,8.11 C5.2 | v127.05,14.25 127.57,14.77 CR1.4 128.68,14.77 129.16,14.29 129.69,14.12 130.32,14.12 CR1.2 131.89,13.53 C2.2 132.62,14.62 C1.2 | v116.45,23.25 117.9,23.25 C3.2
  Bottom 0.813: v144.5,87 146.9,84.6 155.35,84.6 156.65,85.9 162.5,85.9 163.85,87.25 163.85,90.65 161,93.5 158.92,93.5 158.09,94.33 J1.P$14 157.16,94.31 157.06,94.31 | 150.28,94.31 149.41,95.17 J1.P$16
  pour Bottom: 107.5,24 107.5,6 arc90 108.5,5 132.5,5 arc90 133.5,6 133.5,24 arc90 132.5,25 108.5,25 arc90
  pour Top: 107.5,24 107.5,6 arc90 108.5,5 132.5,5 arc90 133.5,6 133.5,24 arc90 132.5,25 108.5,25 arc90
N$1
  Bottom 0.305: TAB.MX2 16.39,75.64 DTAB.A
N$2
  Bottom 0.305: Q.MX2 43.63,75.56 DQ.A
N$3
  Bottom 0.305: W.MX2 59.2,75.64 DW.A
N$4
  Bottom 0.305: E.MX2 81.73,75.56 DE.A
N$5
  Bottom 0.305: R.MX2 100.78,75.56 DR.A
N$6
  Bottom 0.305: T.MX2 116.17,75.64 DT.A
N$7
  Bottom 0.305: Y.MX2 138.88,75.56 DY.A
N$8
  Bottom 0.305: U.MX2 157.94,75.56 DU.A
N$9
  Bottom 0.305: I.MX2 176.99,75.56 DI.A
N$10
  Bottom 0.305: O.MX2 196.06,75.59 DO.A
N$11
  Bottom 0.305: P.MX2 211.51,75.14 DP.A
N$12
  Bottom 0.305: SPACE3.MX2 235.18,75.14 DSPACE3.A
N$13
  Bottom 0.305: KP_7.MX2 267.62,75.56 DKP_7.A
N$14
  Bottom 0.305: KP_8.MX2 286.67,75.56 DKP_8.A
N$15
  Bottom 0.305: KP_9.MX2 305.71,75.56 DKP_9.A
N$16
  Bottom 0.305: NUMLOCK.MX2 263.8,94.19 DNUMLOCK.A
N$17
  Bottom 0.305: CAPSLOCK.MX2 13.92,56.56 SPACE5.MX2 22.48,56.56 DCAPSLOCK.A
N$18
  Bottom 0.305: A.MX2 48.45,56.56 DA.A
N$19
  Bottom 0.305: S.MX2 67.5,56.56 DS.A
N$20
  Bottom 0.305: D.MX2 86.55,56.56 DD.A
N$21
  Bottom 0.305: F.MX2 105.59,56.56 DF.A
N$22
  Bottom 0.305: G.MX2 124.64,56.56 DG.A
N$23
  Bottom 0.305: H.MX2 143.69,56.56 DH.A
N$24
  Bottom 0.305: J.MX2 162.75,56.56 DJ.A
N$25
  Bottom 0.305: K.MX2 181.79,56.56 DK.A
N$26
  Bottom 0.305: L.MX2 200.84,56.56 DL.A
N$27
  Bottom 0.305: SPACE6.MX2 219.9,56.56 DSPACE6.A
N$28
  Top 0.305: SPACE7.MX2 229.57,58.43 SPACE4.MX2
  Bottom 0.305: SPACE7.MX2 229.36,56.56 231.46,58.66 233.44,58.66 235.53,56.56 SPACE8.MX2 241.1,56.56 DSPACE4.A
N$29
  Bottom 0.305: SCROLLLOCK.MX2 282.8,94.19 DSCROLLLOCK.A
N$30
  Bottom 0.305: KP_4.MX2 267.67,56.56 DKP_4.A
N$31
  Bottom 0.305: KP_5.MX2 286.71,56.56 DKP_5.A
N$32
  Bottom 0.305: KP_6.MX2 305.76,56.56 DKP_6.A
N$33
  Bottom 0.305: SPACE9.MX2 17.54,37.56 DSHIFT.A 13.96,37.53 SHIFT.MX2
N$34
  Bottom 0.305: INSERT.MX2 302.5,93.48 DINSERT.A
N$35
  Bottom 0.305: SPACE10.MX2 38.91,37.56 DSPACE10.A
N$36
  Bottom 0.305: Z.MX2 54.34,37.53 DZ.A
N$37
  Bottom 0.305: X.MX2 77.02,37.56 DX.A
N$38
  Bottom 0.305: C.MX2 96.06,37.56 DC.A
N$39
  Bottom 0.305: V.MX2 111.34,37.53 DV.A
N$40
  Bottom 0.305: B.MX2 130.78,38.02 133.7,38.02 DB.A
N$41
  Bottom 0.305: N.MX2 153.22,37.56 DN.A
N$42
  Bottom 0.305: M.MX2 168.44,37.53 DM.A
N$43
  Bottom 0.305: SPACE11.MX2 191.31,37.56 DSPACE11.A
N$44
  Bottom 0.305: SHIFT2.MX2 215.13,37.56 DSHIFT2.A
N$45
  Bottom 0.305: KP_1.MX2 263.44,37.53 DKP_1.A
N$46
  Bottom 0.305: KP_2.MX2 282.44,37.53 DKP_2.A
N$47
  Bottom 0.305: KP_3.MX2 301.44,37.53 DKP_3.A
N$48
  Bottom 0.305: SPACE12.MX2 DSPACE12.A
N$49
  Bottom 0.305: CTRL.MX2 17.43,18.56 DCTRL.A
N$50
  Bottom 0.305: WIN.MX2 38.87,18.56 DWIN.A
N$51
  Bottom 0.305: ALT.MX2 57.9,18.51 DALT.A
N$52
  Bottom 0.305: SPACE13.MX2 106.08,18.56 DSPACE13.A
N$53
  Bottom 0.305: BACKSPACE2.MX2 96.05,18.56 DBACKSPACE2.A
N$54
  Bottom 0.305: SPACE14.MX2 143.68,18.56 DSPACE14.A
N$55
  Bottom 0.305: FN.MX2 177.03,18.46 DFN.A
N$56
  Bottom 0.305: MENU.MX2 198.47,18.51 DMENU.A
N$57
  Bottom 0.305: KP_0.MX2 282.5,18.48 DKP_0.A
N$58
  Bottom 0.305: DDEL.A 301.5,18.48 DEL.MX2
N$59
  Bottom 0.305: SPACE15.MX2 224.6,13.8 DSPACE15.A
N$60
  Bottom 0.305: SPACE16.MX2 243.66,13.8 DSPACE16.A
N$61
  Bottom 0.305: SPACE17.MX2 262.7,13.8 DSPACE17.A
N$62
  Bottom 0.305: SPACE.MX2 224.35,94.51 DSPACE.A
N$63
  Bottom 0.305: 0.MX2 201.88,94.19 D0.A
N$64
  Bottom 0.305: 9.MX2 182.88,94.19 D9.A
N$65
  Bottom 0.305: 8.MX2 163.94,94.19 D8.A
N$66
  Bottom 0.305: D7.A 7.MX2
N$67
  Bottom 0.305: 6.MX2 128.25,94.56 D6.A
N$68
  Bottom 0.305: 5.MX2 106.94,94.19 D5.A
N$69
  Bottom 0.305: ESC.MX2 11.94,94.19 DESC.A
N$70
  Bottom 0.305: 1.MX2 30.93,94.19 D1.A
N$71
  Bottom 0.305: 2.MX2 49.94,94.19 D2.A
N$72
  Bottom 0.305: 3.MX2 68.94,94.19 D3.A
N$73
  Bottom 0.305: 4.MX2 87.94,94.19 D4.A
N$74
  Bottom 0.305: R6.1 152.45,90.6 154.5,92.65 J1.P$8 154.51,94.31 154.51,95.49 154.35,95.65 153.6,95.65 153.5,95.55 J1.P$6
N$75
  Bottom 0.305: J1.P$7 154,93.4 153.38,92.78 | R5.1 153.38,92.78 | J1.P$5 153,93.15 153.38,92.78
N$76
  Top 0.305: SPACE2.MX2 BACKSPACE.MX2
  Bottom 0.305: BACKSPACE.MX2 233.88,94.51 DBACKSPACE.A
N$77
  Bottom 0.305: R3.1 155.5,91.75 J1.P$10
N$78
  Bottom 0.305: R4.1 152.5,93.45 J1.P$4
N$87
  Bottom 0.305: C3.1 118.2,19.91 U2.6
N$88
  Bottom 0.305: R1.1 114.21,7.95 114.5,8.24 U2.33
N$89  (via drill 0.35)
  Top 0.305: v156.75,12.55 155.35,13.95 SW1.1
  Bottom 0.305: R2.2 156.6,12.4 v156.75,12.55 158.27,14.07 SW2.1
ROW1
  Bottom 0.305: DINSERT.C 287.44,96.75 DSCROLLLOCK.C DNUMLOCK.C 244.73,97.45 240.21,92.94 238.91,92.94 234.39,97.45 DBACKSPACE.C DSPACE.C 219.21,97.45 216.36,94.6 214.84,94.6 211.99,97.45 D0.C D9.C D8.C 166.9,98.08 142.3,98.08 D7.C 140.77,97.61 D6.C 110.53,97.61 D5.C D4.C D3.C D2.C D1.C DESC.C 4.75,97.45 0.38,93.08 0.38,23.97 6.75,17.6 12.67,17.6 13.29,16.98 14.59,16.98 15.21,17.6 34.05,17.6 34.67,16.98 35.97,16.98 36.59,17.6 55.38,17.6 56.05,16.94 57.35,16.94 58.02,17.6 93.43,17.6 94.05,16.98 95.35,16.98 95.97,17.6 100.25,17.6 101.32,16.53 106.88,16.53 111.5,21.15 113.46,21.15 114.5,20.11 U2.1
ROW2  (via drill 0.35)
  Top 0.305: v101.9,77.8 101.9,74.57 92.7,65.37 92.7,60.76 89.01,57.07 89.01,37.58 92.54,34.06 92.54,17 94.92,14.62 94.92,10.23 v96.5,8.66
  Bottom 0.305: DTAB.C DQ.C DW.C DE.C DR.C | DR.C DT.C DY.C DU.C DI.C DO.C 214.63,78.91 214.65,78.89 214.68,78.89 DP.C DSPACE3.C 267.19,78.41 DKP_7.C DKP_8.C DKP_9.C | DR.C 101.9,77.86 v101.9,77.8 | v96.5,8.66 96.73,8.88 106.26,8.88 108.14,6.99 115.34,6.99 116.1,7.75 U2.31
ROW3  (via drill 0.35)
  Top 0.305: v88.1,58.45 88.1,34.39 87.47,33.76 87.47,19.12 89.92,16.67 89.92,14.17 89.86,14.1 89.86,9.81 v90.55,9.12
  Bottom 0.305: DKP_6.C DKP_5.C DKP_4.C 245.97,59.85 DSPACE4.C 241.82,64 233.5,64 229.35,59.85 DSPACE6.C 214.47,59.85 214.02,60.31 212.5,60.31 212.05,59.85 DL.C DK.C DJ.C DH.C DG.C DF.C DD.C | DD.C DS.C DA.C DCAPSLOCK.C | DD.C 87.97,58.45 v88.1,58.45 | v90.55,9.12 90.78,9.35 106.21,9.35 108.46,11.6 U2.36
ROW4
  Bottom 0.305: DSHIFT.C 20.2,43.5 36.24,43.5 DSPACE10.C DZ.C DX.C | DX.C DC.C DV.C DB.C DN.C DM.C DSPACE11.C DSHIFT2.C 238.97,40.8 DSPACE12.C 248.49,40.8 DKP_1.C DKP_2.C DKP_3.C | DX.C 78.94,38.9 79,38.9 79,27.65 80.54,26.11 119.24,26.11 121.7,23.64 U2.10
ROW5.25  (via drill 0.35)
  Top 0.305: v113.8,24.2 123.7,24.2 v123.8,24.3
  Bottom 0.305: DDEL.C DKP_0.C 267.54,21.75 DSPACE17.C DSPACE16.C DSPACE15.C 203.25,17 DMENU.C DFN.C 174.56,24.25 DSPACE14.C 146.06,24.3 v123.8,24.3 | DCTRL.C DWIN.C 41.44,24.25 DALT.C DBACKSPACE2.C 99.24,25.03 107.73,25.03 DSPACE13.C 108.55,24.2 113.7,24.2 113.71,24.2 v113.8,24.2 117.37,24.2 117.57,24.41 119.64,24.41 120.1,23.95 U2.8
RST  (via drill 0.35)
  Top 0.305: v133.75,15.15 133.75,14.3 133.41,13.96 133.41,12.09 134.7,10.8 158.35,10.8 SW1.2 161.63,14.08 v156.79,14.08
  Bottom 0.305: U2.13 124.7,17.2 125.5,18 128.5,18 129.5,19 131.65,19 133.75,16.9 v133.75,15.15 | SW2.2 156.78,14.07 v156.79,14.08
XTAL1
  Bottom 0.305: 129.25,12.77 CR1.3 | U2.17 124.15,14.03 126.25,14.03 127.27,13.02 129,13.02 129.25,12.77 | C2.1 132.31,12.25 129.77,12.25 129.25,12.77
XTAL2
  Bottom 0.305: U2.16 124.2,14.72 126.12,14.72 127.45,16.04 129.18,16.04 129.69,15.53 CR1.1 129.85,16.27 C1.1

### Text on the board
bPlace: C:/Users/Elliot/Downloads/akblogo (1).bmp
bNames: Raine By AKB | PCB By Elliot Powell